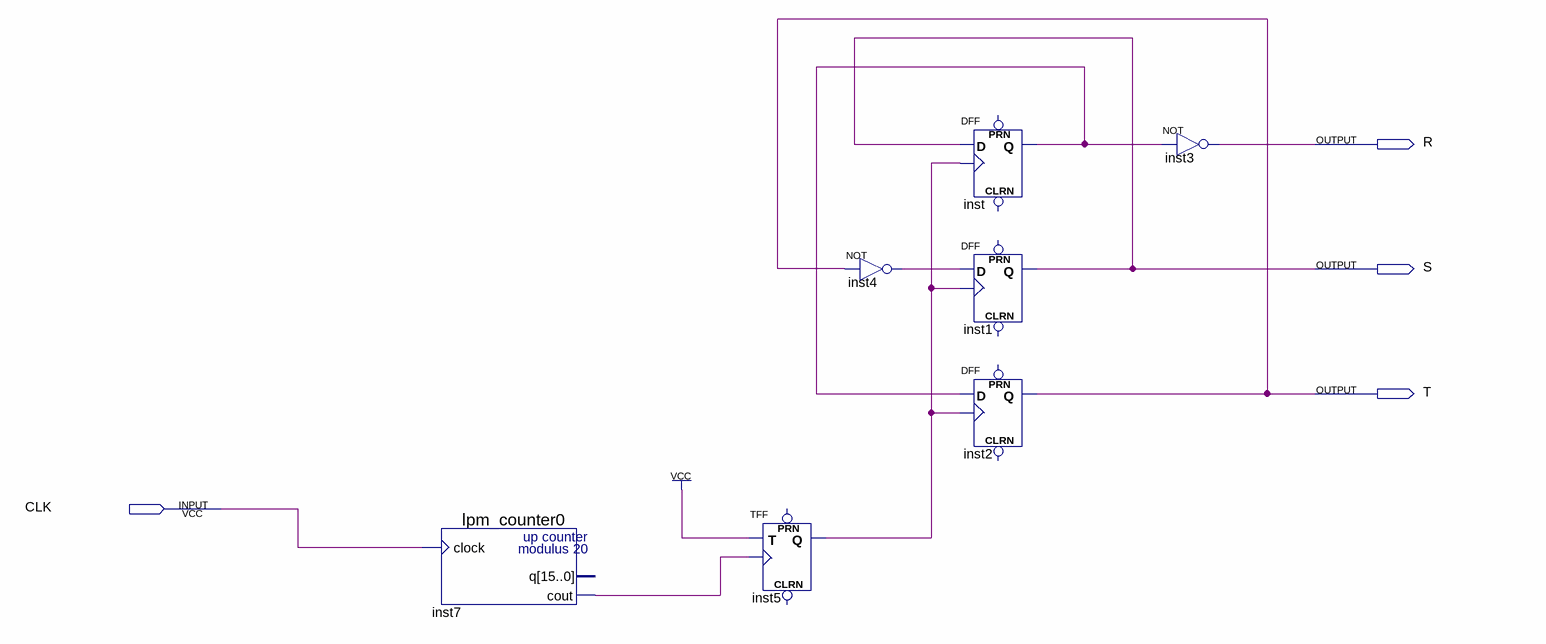
[diagram p0: schematic sheet]
// Quartus schematic GeradorRST.bdf as structural Verilog: 7 symbols, 4 pins
module GeradorRST (
  input  CLK,
  output R,
  output S,
  output T
);

  wire inst4_out, inst5_q, inst7_cout, inst_q;

  lpm_counter0 inst7 (.clock(CLK), .cout(inst7_cout));  // open: q
  TFF inst5 (.T(1'b1), .CLK(inst7_cout), .Q(inst5_q));  // open: PRN, CLRN
  not inst4 (inst4_out, T);
  DFF inst (.CLK(inst5_q), .D(S), .Q(inst_q));  // open: CLRN, PRN
  DFF inst1 (.CLK(inst5_q), .D(inst4_out), .Q(S));  // open: CLRN, PRN
  DFF inst2 (.CLK(inst5_q), .D(inst_q), .Q(T));  // open: CLRN, PRN
  not inst3 (R, inst_q);
endmodule
